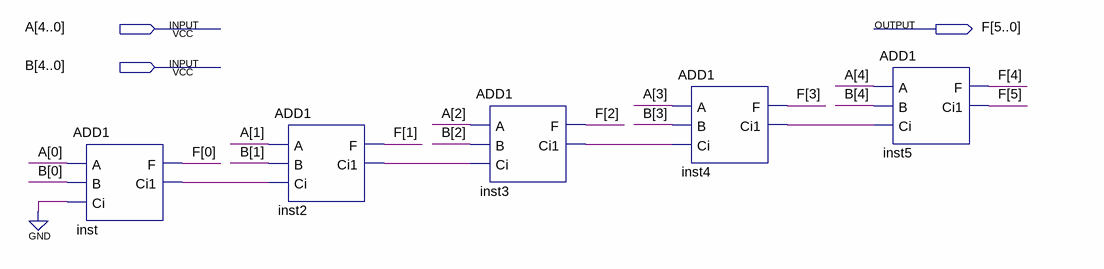
[diagram p0: schematic sheet]
// Quartus schematic ADD5.bdf as structural Verilog: 5 symbols, 3 pins
module ADD5 (
  input  [4:0] A,
  input  [4:0] B,
  output [5:0] F
);

  wire inst2_ci1, inst3_ci1, inst4_ci1, inst_ci1;

  ADD1 inst (.A(A[0]), .B(B[0]), .Ci(1'b0), .F(F[0]), .Ci1(inst_ci1));
  ADD1 inst2 (.A(A[1]), .B(B[1]), .Ci(inst_ci1), .F(F[1]), .Ci1(inst2_ci1));
  ADD1 inst3 (.A(A[2]), .B(B[2]), .Ci(inst2_ci1), .F(F[2]), .Ci1(inst3_ci1));
  ADD1 inst4 (.A(A[3]), .B(B[3]), .Ci(inst3_ci1), .F(F[3]), .Ci1(inst4_ci1));
  ADD1 inst5 (.A(A[4]), .B(B[4]), .Ci(inst4_ci1), .F(F[4]), .Ci1(F[5]));
endmodule
